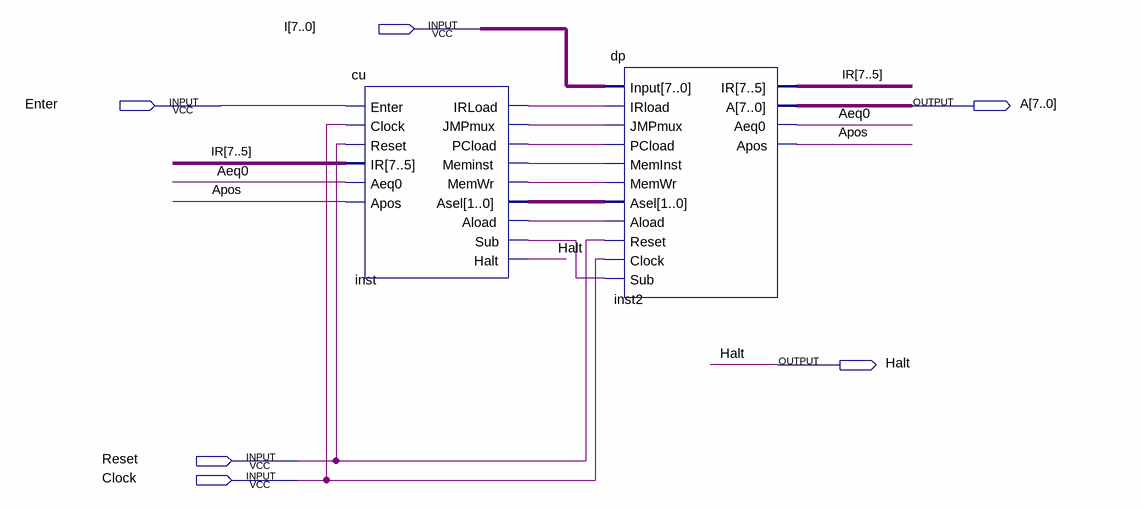
[diagram p0: schematic sheet]
// Quartus schematic EC2.bdf as structural Verilog: 2 symbols, 6 pins
module EC2 (
  input  [7:0] I,
  input  Enter,
  input  Reset,
  input  Clock,
  output [7:0] A,
  output Halt
);

  wire Aeq0, Apos, inst_aload, inst_irload, inst_jmpmux, inst_meminst, inst_memwr, inst_pcload, inst_sub;
  wire [1:0] inst_asel;
  wire [7:5] IR;

  cu inst (
    .Enter(Enter), .Clock(Clock), .Reset(Reset), .IR(IR), .Aeq0(Aeq0), .Apos(Apos), .IRLoad(inst_irload),
    .JMPmux(inst_jmpmux), .PCload(inst_pcload), .Meminst(inst_meminst), .MemWr(inst_memwr), .Asel(inst_asel),
    .Aload(inst_aload), .Sub(inst_sub), .Halt(Halt));
  dp inst2 (
    .Input(I), .IRload(inst_irload), .JMPmux(inst_jmpmux), .PCload(inst_pcload), .MemInst(inst_meminst),
    .MemWr(inst_memwr), .Asel(inst_asel), .Aload(inst_aload), .Reset(Reset), .Clock(Clock), .Sub(inst_sub),
    .IR(IR), .A(A), .Aeq0(Aeq0), .Apos(Apos));
endmodule
